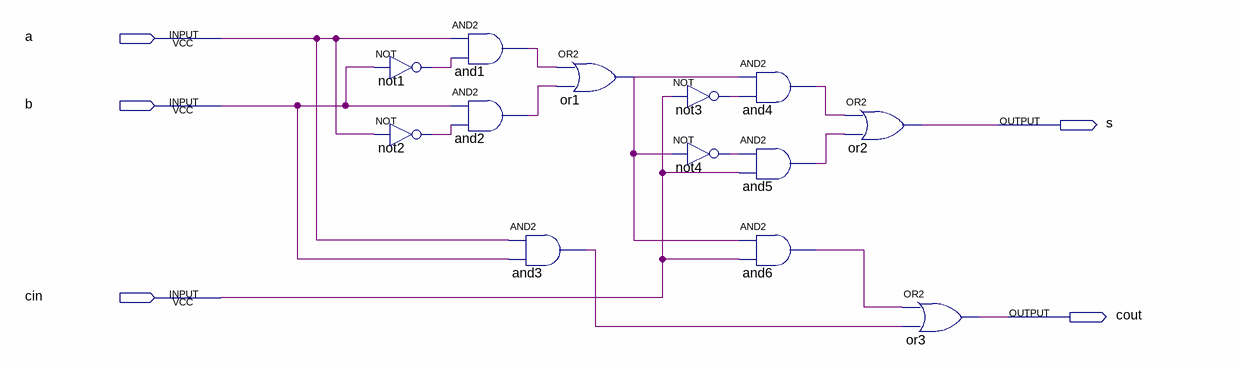
[diagram p0: schematic sheet]
// Quartus schematic FA.bdf as structural Verilog: 13 symbols, 5 pins
module FA (
  input  a,
  input  b,
  input  cin,
  output s,
  output cout
);

  wire and1_out, and2_out, and3_out, and4_out, and5_out, and6_out, not1_out, not2_out, not3_out, not4_out,
       or1_out;

  not not1 (not1_out, b);
  not not2 (not2_out, a);
  and and1 (and1_out, a, not1_out);
  and and2 (and2_out, b, not2_out);
  or or1 (or1_out, and1_out, and2_out);
  and and3 (and3_out, a, b);
  not not3 (not3_out, cin);
  not not4 (not4_out, or1_out);
  and and4 (and4_out, or1_out, not3_out);
  and and5 (and5_out, not4_out, cin);
  and and6 (and6_out, or1_out, cin);
  or or2 (s, and4_out, and5_out);
  or or3 (cout, and6_out, and3_out);
endmodule
